# EasyEDA Pro project sincon_badge.eprj, board 2-PCB_PCB_Smooth_Yuzuki2040
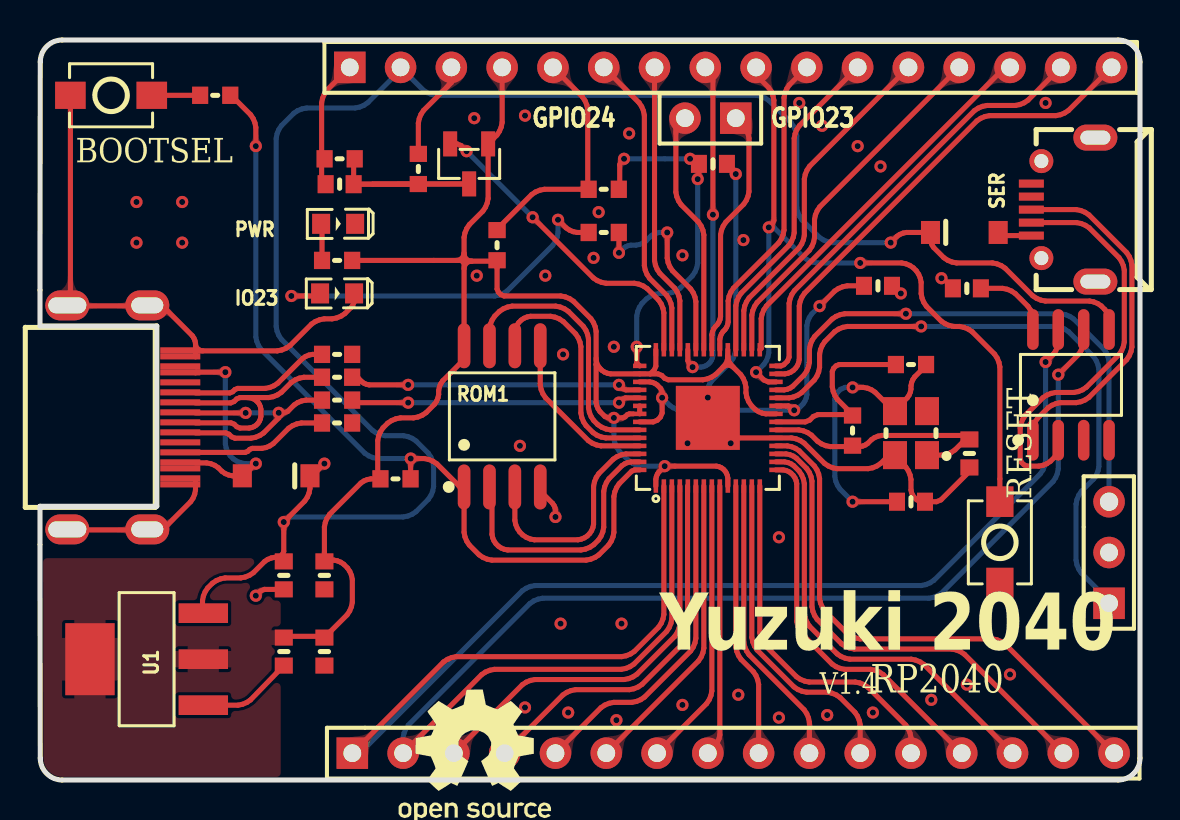
[diagram p4: board, top side]
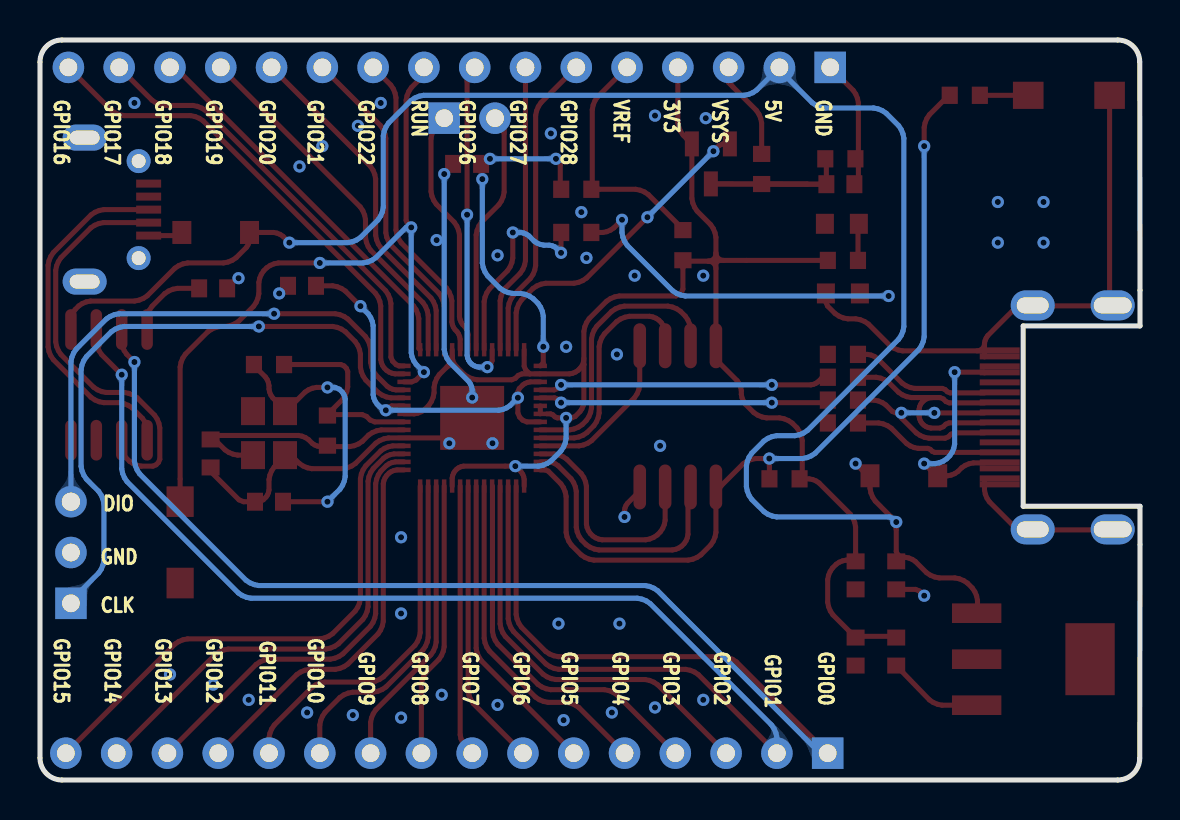
[diagram p5: board, bottom side, seen from below]

Outline 55.01 x 37 mm; copper layers: Top Layer, Bottom Layer. Coordinates in mm from the lower left corner of the outline.
Outline path: 0,24.48 0.01,35.9 arc(0.34,36.68) 1.11,37 53.91,37 arc(54.69,36.68) 55.01,35.9 55.01,1.1 arc(54.69,0.32) 53.91,0 1.11,0 arc(0.34,0.32) 0.01,1.1 0,11.76

## Design rules (mm)
via Default (default): diameter min 0.457, default 0.457, max 100.025; hole min 0.203, default 0.203, max 59.995
pour e307 uses gge9161
pour e1699 uses gge15034
pour e1701 uses gge15036

## Placement (name value [footprint] x y rotation side)
BOOTSEL  TSA343G00-250J2  [SW-SMD_L4.0-W2.9-LS5.0]  3.56 34.23 0 top
C1  0.1uf  [C0603 NSK]  12.19 6.42 270 top
C2  0.1uf  [C0603 NSK]  12.19 10.23 270 top
C3  0.1u  [C0603 NSK]  33.66 30.81 180 top
C4  0.1u  [C0603 NSK]  14.22 10.23 90 top
C5  2.2u  [C0603 NSK]  14.22 6.42 90 top
C6  1n  [C0603 NSK]  14.99 29.79 0 top
C7  15p  [C0603 NSK]  46.48 16.33 90 top
C8  15p  [C0603 NSK]  43.56 13.91 180 top
C9  0.1u  [C0603 NSK]  41.91 24.71 0 top
C10  10n  [C0603 NSK]  46.36 24.58 180 top
D1  1N4007W  [SOD-123 NSK]  11.81 15.21 180 top
D2  1N4007W  [SOD-123 NSK]  46.23 27.38 0 top
H1  HDR-F-2.54_1x3  [HDR-F-2.54_1X3]  53.47 11.37 90 top
H2  HDR-F-2.54_1x16  [HDR-F-2.54_1X16]  34.67 1.34 0 top
H3  HDR-F-2.54_1x16  [HDR-F-2.54_1X16]  34.54 35.63 0 top
H4  HDR-F-2.54_1x2  [HDR-F-2.54_1X2]  33.53 33.09 180 top
IO23  LED-0603_G  [LED0603_GREEN]  14.86 24.33 0 top
PWR  LED-0603_G  [LED0603_GREEN]  14.91 27.81 0 top
Q2  AO3404  [SOT-23-3_L2.9-W1.3-P1.90-LS2.4-BR]  21.46 30.81 90 top
R1  27  [R0603 NSK]  14.86 18.99 180 top
R2  27  [R0603 NSK]  14.86 20.14 180 top
R3  1K  [R0603 NSK]  14.86 25.98 180 top
R4  DNF（不装）  [R0603 NSK]  17.78 15.06 180 top
R5  1k  [R0603 NSK]  8.76 34.23 0 top
R6  1R  [R0603 NSK]  28.19 29.54 180 top
R7  200R  [R0603 NSK]  22.86 26.74 270 top
R8  470  [R0603 NSK]  28.19 27.38 180 top
R9  200k  [R0603 NSK]  18.92 30.55 90 top
R10  DNF  [R0603 NSK]  40.64 17.47 90 top
R11  100k  [R0603 NSK]  14.99 31.06 0 top
R12  1k  [R0603 NSK]  43.56 20.77 180 top
R13  1k  [R0603 NSK]  14.86 21.28 180 top
R14  1k  [R0603 NSK]  14.86 17.85 180 top
RESET  TSA343G00-250J2  [SW-SMD_L4.0-W2.9-LS5.0]  48.01 11.88 270 top
ROM1  W25Q16JVSSIQ  [SOIC-8_L5.3-W5.3-P1.27-LS8.0-BL]  23.11 18.18 0 top
SER  MICROUSB FEMALE  [MICRO-USB-SMD_5P-P0.65-H-F_C10418]  51.18 28.52 90 top
U1  AMS1117-3.3V  [SOT-223-4_L6.5-W3.5-P2.30-LS7.0-BR]  5.33 6.04 0 top
U2  RP2040  [QFN-56_L7.0-W7.0-P0.90-TL-EP3.2]  33.4 18.11 90 top
U3  CH340N  [SOP-8_L5.0-W4.0-P1.27-LS6.0-BL]  51.56 19.76 0 top
USB1  TYPE-C  [USB-C-SMD_TYC-302-16]  4.19 18.13 270 top
X1  12MHz  [OSC-SMD_4P-L3.2-W2.5-BL-1]  43.56 17.34 90 top

## Footprints (pads in the part's own frame, mm; a bottom-side part is the same pattern mirrored in y, then rotated)
C0603 NSK
  rect 0.8x0.9 smd: 1(-0.7,0) 2(0.7,0)
HDR-F-2.54_1X2
  rect 1.575x1.575 hole 0.889: 1(-1.27,0)
  round 1.575 hole 0.889: 2(1.27,0)
HDR-F-2.54_1X3
  rect 1.575x1.575 hole 0.889: 1(-2.54,0)
  round 1.575 hole 0.889: 2(0,0)
  round 1.575 hole 0.914: 3(2.54,0)
HDR-F-2.54_1X16
  rect 1.575x1.575 hole 0.889: 1(-19.05,0)
  round 1.575 hole 0.889: 2(-16.51,0) 3(-13.97,0) 4(-11.43,0) 5(-8.89,0) 6(-6.35,0) 7(-3.81,0) 8(-1.27,0) 9(1.27,0) 10(3.81,0) 11(6.35,0) 12(8.89,0) 13(11.43,0) 14(13.97,0) 15(16.51,0) 16(19.05,0)
LED0603_GREEN
  rect 0.9x1 smd: 1(-0.85,0) 2(0.85,0)
MICRO-USB-SMD_5P-P0.65-H-F_C10418
  oval 1.3x2.2 hole 0.7x1.5: 0(-3.6,-1.6) 0(3.6,-1.6)
  round 1.2 hole 0.7: 0(-2.425,1.1) 0(2.425,1.1)
  rect 0.4x1.25 smd: 1(-1.3,1.6) 2(-0.65,1.6) 3(0,1.6) 4(0.65,1.6) 5(1.3,1.6)
OSC-SMD_4P-L3.2-W2.5-BL-1
  rect 1.4x1.2 smd: 1(-1.1,-0.8) 2(1.1,-0.8) 3(1.1,0.8) 4(-1.1,0.8)
QFN-56_L7.0-W7.0-P0.90-TL-EP3.2
  rect 0.665x0.224 smd: 1(-3.408,2.6) 2(-3.408,2.2) 3(-3.408,1.8) 4(-3.408,1.4) 5(-3.408,1) 6(-3.408,0.6) 7(-3.408,0.2) 8(-3.408,-0.2) 9(-3.408,-0.6) 10(-3.408,-1) 11(-3.408,-1.4) 12(-3.408,-1.8) 13(-3.408,-2.2) 14(-3.408,-2.6) 29(3.408,-2.6) 30(3.408,-2.2) 31(3.408,-1.8) 32(3.408,-1.4) 33(3.408,-1) 34(3.408,-0.6) 35(3.408,-0.2) 36(3.408,0.2) 37(3.408,0.6) 38(3.408,1) 39(3.408,1.4) 40(3.408,1.8) 41(3.408,2.2) 42(3.408,2.6)
  rect 0.224x0.665 smd: 15(-2.6,-3.408) 16(-2.2,-3.408) 17(-1.8,-3.408) 18(-1.4,-3.408) 19(-1,-3.408) 20(-0.6,-3.408) 21(-0.2,-3.408) 22(0.2,-3.408) 23(0.6,-3.408) 24(1,-3.408) 25(1.4,-3.408) 26(1.8,-3.408) 27(2.2,-3.408) 28(2.6,-3.408) 43(2.6,3.408) 44(2.2,3.408) 45(1.8,3.408) 46(1.4,3.408) 47(1,3.408) 48(0.6,3.408) 49(0.2,3.408) 50(-0.2,3.408) 51(-0.6,3.408) 52(-1,3.408) 53(-1.4,3.408) 54(-1.8,3.408) 55(-2.2,3.408) 56(-2.6,3.408)
  rect 3.2x3.2 smd: 57(0,0)
R0603 NSK
  rect 0.806x0.864 smd: 1(-0.753,0) 2(0.753,0)
SOD-123 NSK
  rect 0.95x1.15 smd: 1(-1.692,0) 2(1.692,0)
SOIC-8_L5.3-W5.3-P1.27-LS8.0-BL
  oval 0.63x2.25 smd: 1(-1.905,-3.53) 2(-0.635,-3.53) 3(0.635,-3.53) 4(1.905,-3.53) 5(1.905,3.53) 6(0.635,3.53) 7(-0.635,3.53) 8(-1.905,3.53)
SOP-8_L5.0-W4.0-P1.27-LS6.0-BL
  oval 0.574x2.035 smd: 1(-1.905,-2.768) 2(-0.635,-2.768) 3(0.635,-2.768) 4(1.905,-2.768) 5(1.905,2.768) 6(0.635,2.768) 7(-0.635,2.768) 8(-1.905,2.768)
SOT-23-3_L2.9-W1.3-P1.90-LS2.4-BR
  rect 1.25x0.7 smd: 1(1,-0.95) 2(1,0.95) 3(-1,0)
SOT-223-4_L6.5-W3.5-P2.30-LS7.0-BR
  rect 2.47x0.98 smd: 1(2.835,-2.3) 2(2.835,0) 3(2.835,2.3)
  rect 2.47x3.6 smd: 4(-2.835,0)
SW-SMD_L4.0-W2.9-LS5.0
  rect 1.53x1.36 smd: 1(-2.035,0) 2(2.035,0)
USB-C-SMD_TYC-302-16
  oval 1.5x2.2 hole 0.8x1.6: 1(-5.6,1.175) 2(5.6,1.175)
  oval 1.5x2.2 hole 0.8x1.9: 3(-5.6,-2.825) 4(5.6,-2.825)
  rect 0.3x2 smd: A1(-3.35,2.825) A4(-2.55,2.825) A5(-1.25,2.825) A6(-0.25,2.825) A7(0.25,2.825) A8(-1.75,2.825) A9(2.55,2.825) A12(3.35,2.825) B1(3.05,2.825) B4(2.25,2.825) B5(1.75,2.825) B6(0.75,2.825) B7(-0.75,2.825) B8(1.25,2.825) B9(-2.25,2.825) B12(-3.05,2.825)

## Nets
1V1: C9.1 U2.23 U2.45 U2.50
3V3: C1.1 C4.2 C5.2 H3.4 Q2.1 R3.1 R4.2 R7.2 ROM1.8 U1.2 U1.4 U2.1 U2.10 U2.22 U2.33 U2.42 U2.44 U2.48 U2.49
GND: BOOTSEL.1 C1.2 C2.2 C3.1 C4.1 C5.1 C6.1 C7.1 C8.1 C9.2 C10.2 H1.2 H3.1 IO23.2 PWR.2 R11.1 R13.1 R14.1 RESET.2 ROM1.4 SER.0 SER.5 U1.1 U2.19 U2.57 U3.3 USB1.1 USB1.2 USB1.3 USB1.4 USB1.A1 USB1.A12 USB1.B1 USB1.B12 X1.2 X1.4
VBUS: C2.1 D1.1 D2.1 H3.2 U1.3 U3.5
ADC_AVDD: C3.2 R6.1 U2.43
ADC_VREF: H3.5 R6.2 R7.1
BOOTSEL_2: BOOTSEL.2 R5.1
CC1: R13.2 USB1.A5
CC2: R14.2 USB1.B5
D2_2: D2.2 SER.1
GPIO0: H2.1 U2.2 U3.7
GPIO1: H2.2 U2.3 U3.6
GPIO2: H2.3 U2.4
GPIO3: H2.4 U2.5
GPIO4: H2.5 U2.6
GPIO5: H2.6 U2.7
GPIO6: H2.7 U2.8
GPIO7: H2.8 U2.9
GPIO8: H2.9 U2.11
GPIO9: H2.10 U2.12
GPIO10: H2.11 U2.13
GPIO11: H2.12 U2.14
GPIO12: H2.13 U2.15
GPIO13: H2.14 U2.16
GPIO14: H2.15 U2.17
GPIO15: H2.16 U2.18
GPIO16: H3.16 U2.27
GPIO17: H3.15 U2.28
GPIO18: H3.14 U2.29
GPIO19: H3.13 U2.30
GPIO20: H3.12 U2.31
GPIO21: H3.11 U2.32
GPIO22: H3.10 U2.34
GPIO23: H4.1 U2.35
GPIO24: H4.2 U2.36
GPIO25: R8.1 U2.37
GPIO26_ADC0: H3.8 U2.38
GPIO27_ADC1: H3.7 U2.39
GPIO28_ADC2: H3.6 U2.40
GPIO29_ADC3: Q2.2 U2.41
PWR_1: PWR.1 R3.2
Q2_3: C6.2 Q2.3 R9.1 R11.2
QSPI_SCLK: ROM1.6 U2.52
QSPI_SD0: ROM1.5 U2.53
QSPI_SD1: ROM1.2 U2.55
QSPI_SD2: ROM1.3 U2.54
QSPI_SD3: ROM1.7 U2.51
QSPI_SS: R4.1 R5.2 ROM1.1 U2.56
R8_2: IO23.1 R8.2
RUN: H3.9 RESET.1 U2.26
SD+: SER.3 U3.1
SD-: SER.2 U3.2
SWCLK: H1.1 U2.24
SWDIO: H1.3 U2.25
U2_46: R2.1 U2.46
U2_47: R1.1 U2.47
U3_8: C10.1 U3.8
USB_D+: R1.2 USB1.A6 USB1.B6
USB_D-: R2.2 USB1.A7 USB1.B7
VSYS: H3.3 R9.2
VUSBC: D1.2 USB1.A4 USB1.A9 USB1.B4 USB1.B9
X1_3: C8.2 R12.1 X1.3
XIN: C7.2 R10.1 U2.20 X1.1
XOUT: R10.2 R12.2 U2.21

Pads without a net: SER 4; U3 4; USB1 A8 B8

## Via types
v1: diameter 0.61, hole 0.305, Top Layer to Bottom Layer, 84 vias

## Routing (per net, layer and track width the routed paths; a pad name or vN(x,y) marks a point on that pad's centre or on a via; arc(x,y) is an arc through that point)
1V1: length 20.3
  Top Layer w0.254: 36.81,18.71 37.42,18.71 37.56,18.65 37.72,18.49 ; U2.50 30.67,17.91 30.87,17.99 31.03,18.15 31.12,18.35 31.12,19.4 31.04,19.57 30.87,19.75 30.75,19.83 30.63,19.88 30.49,19.91 U2.45 ; v1(38.99,23.69) 39.74,24.45 39.94,24.58 40.15,24.66 40.38,24.71 41.01,24.71
  Bottom Layer w0.254: 31.11,19.11 31.5,18.73 31.68,18.61 31.87,18.53 32.08,18.49 37.85,18.49 38.16,18.8 38.25,18.94 38.32,19.1 38.35,19.27 38.35,22.72 38.4,22.93 38.48,23.12 38.6,23.3 v1(38.99,23.69) ; 37.54,18.49 arc(37.82,18.54) 38.06,18.7
  vias: v1(31.11,19.11) v1(37.72,18.49)
3V3: length 85.3
  Top Layer w0.254: 30.52,20.31 30.73,20.51 30.8,20.69 30.8,21.51 ; 30.52,20.31 U2.44 28.53,20.31 28.38,20.34 28.23,20.4 28.1,20.48 27.81,20.77 ; 30.52,20.31 30.91,20.31 31.1,20.23 31.24,20.09 31.42,20.01 33.16,20.01 33.38,20.06 33.6,20.15 33.79,20.27 34.4,20.88 34.4,20.91 ; 21.21,25.98 21.21,27.13 21.25,27.36 21.34,27.57 21.47,27.77 22.15,28.44 22.28,28.64 22.37,28.85 22.41,29.08 22.41,31.43 22.46,31.66 22.55,31.88 22.68,32.07 22.85,32.24 22.98,32.44 23.07,32.65 23.11,32.88 H3.4 ; 21.21,25.98 21.21,25.94 ; 21.21,25.98 21.08,25.98 ; 21.21,25.98 21.21,25.94 ; 12.19,7.18 14.28,7.18 ; 14.28,7.18 15.36,8.26 15.49,8.45 15.58,8.66 15.62,8.89 15.62,10.02 15.58,10.23 15.5,10.42 15.38,10.6 15.19,10.79 15.04,10.89 14.87,10.96 14.7,10.99 14.22,10.99 14.22,12.65 14.27,12.88 14.36,13.1 14.49,13.29 16.05,14.85 16.2,14.95 16.37,15.02 16.55,15.06 17.03,15.06 16.89,15.19 16.89,16.97 16.94,17.2 17.03,17.41 17.15,17.61 17.39,17.84 17.58,17.97 17.8,18.06 18.03,18.11 18.68,18.11 18.91,18.15 19.12,18.24 19.31,18.37 19.73,18.79 19.83,18.94 19.9,19.11 19.94,19.29 19.94,19.47 19.97,19.64 20.04,19.81 20.14,19.96 21.12,20.94 21.21,21.15 21.21,25.85 ; 14.28,7.18 C5.2 ; 34.4,20.91 35.04,20.27 35.17,20.08 35.26,19.87 35.31,19.64 35.31,19.37 35.35,19.14 35.44,18.92 35.57,18.73 35.78,18.53 35.94,18.42 36.11,18.34 36.3,18.31 36.81,18.31 ; 34.4,20.91 34.4,21.51 ; 15.66,25.98 21.08,25.98 ; 2.54,6.04 U1.4 ; 21.12,25.94 21.21,25.94 ; 21.12,25.94 21.21,25.85 ; 21.12,25.94 21.08,25.98 ; 21.21,25.94 21.21,25.85 ; 21.21,25.94 22.51,25.94 22.67,25.88 22.79,25.75 22.86,25.59 22.86,24.55 22.93,24.39 23.05,24.27 23.21,24.2 26.04,24.2 26.27,24.16 26.49,24.07 26.68,23.94 27.55,23.07 27.68,22.87 27.77,22.66 27.81,22.43 27.81,20.77 ; 27.81,20.77 27.81,18.89 27.85,18.72 27.91,18.56 28.01,18.42 28.25,18.18 28.42,18.11 v1(28.7,18.11) 29.14,18.11 29.26,18.16 29.37,18.26 29.47,18.31 29.66,18.31 ; U2.10 34.4,15.09 34.38,15.22 34.33,15.34 34.26,15.45 34.18,15.54 34.07,15.62 33.96,15.67 33.83,15.69 31.37,15.69 31.15,15.6 30.95,15.4 30.88,15.29 30.83,15.17 30.8,15.04 U2.1 ; U2.48 U2.49 ; 34.18,20.67 arc(34.34,20.91) 34.4,21.19 ; 21.21,26.32 arc(21.32,26.05) 21.59,25.94 arc(21.32,25.83) 21.21,25.56 ; 34.4,21.22 arc(34.46,20.94) 34.62,20.7 ; 20.83,25.98 arc(21.1,26.09) 21.21,26.36 ; 27.81,21.08 arc(27.87,20.8) 28.03,20.56 ; 34.69,20.63 arc(34.42,20.74) 34.15,20.63 ; 13.98,7.18 arc(14.26,7.24) 14.5,7.4 ; 14.22,11.37 arc(14.34,11.11) 14.61,10.99
  Bottom Layer w0.254: v1(31.24,15.69) 30.09,15.69 29.86,15.74 29.65,15.83 29.45,15.96 28.97,16.45 28.84,16.64 28.75,16.85 28.7,17.08 v1(28.7,18.11)
GND: length 76.6
  Top Layer w0.254: 7.78,21.46 11.87,21.46 12.1,21.5 12.31,21.59 12.5,21.72 13.58,22.8 13.77,22.92 13.99,23.01 14.22,23.06 14.61,23.06 14.84,23.1 15.06,23.19 15.25,23.32 15.63,23.7 15.71,23.89 15.71,24.2 ; 7.78,21.46 7.78,21.83 ; 7.78,21.46 7.78,21.16 ; 10.8,9.22 11.03,9.45 11.23,9.53 12.19,9.53 ; v1(34.8,30.3) 34.8,30.36 34.36,30.81 ; 7.78,21.83 7.75,21.97 7.69,22.1 7.62,22.22 6.39,23.44 6.2,23.57 5.98,23.66 5.75,23.71 1.76,23.71 1.65,23.75 1.57,23.84 1.52,23.95 BOOTSEL.1 ; 7.78,21.83 arc(7.89,21.56) 8.15,21.46 ; 25.02,14.45 25.64,13.83 25.71,13.72 25.76,13.61 25.78,13.48 25.78,13.15 ; 7.78,15.06 7.78,14.5 7.74,14.29 7.65,14.09 7.53,13.91 6.39,12.77 6.2,12.64 5.98,12.55 5.75,12.51 2.13,12.51 ; v1(34.54,16.84) 34.74,17.04 34.91,17.1 37.58,17.1 37.81,17.06 38.03,16.97 38.22,16.84 39.23,15.83 39.43,15.7 39.64,15.61 39.87,15.57 41.42,15.57 41.64,15.61 41.85,15.7 42.04,15.82 42.42,16.2 42.53,16.24 42.65,16.24 42.76,16.2 43.3,15.66 43.43,15.46 43.52,15.25 43.56,15.02 43.56,14.5 43.59,14.38 43.64,14.26 43.71,14.15 43.85,14.01 44.08,13.91 44.84,13.91 45.06,14.01 46.48,15.43 ; H3.1 14.35,34.49 14.22,34.29 14.13,34.08 14.08,33.85 14.08,29.79 ; C1.2 10.53,4.01 10.34,3.88 10.13,3.79 9.9,3.74 U1.1
  Bottom Layer w0.254: v1(33.4,19.12) 33.4,19.51 33.43,19.66 33.49,19.8 33.57,19.93 34.53,20.89 34.66,21.08 34.75,21.3 34.8,21.53 v1(34.8,30.3)
  vias: v1(4.83,28.9) v1(4.83,26.87) v1(7.11,28.9) v1(7.11,26.87) v1(10.79,9.22) v1(21.72,33.09) v1(21.84,25.22) v1(21.84,4.01) v1(24,16.71) v1(24.26,33.22) v1(24.26,3.63) v1(25.27,25.22) v1(25.78,13.15) v1(26.03,7.82) v1(26.16,21.28) v1(26.42,3.37) v1(27.69,26.11) v1(27.94,28.39) v1(28.7,21.66) v1(28.83,2.99) v1(29.08,7.82) v1(29.46,32.33) v1(32.13,26.23) v1(32.13,3.75) v1(32.39,16.84) v1(34.92,4.26) v1(35.18,27) v1(36.96,12.14) v1(36.96,8.33) v1(36.96,3.12) v1(37.97,33.85) v1(39.12,32.71) v1(39.37,3.25) v1(40.89,31.69) v1(41.66,3.37) v1(42.04,30.68) v1(43.05,24.33) v1(44.58,4.01) v1(45.09,25.09) v1(46.35,4.77) v1(48.51,5.28) v1(50.29,33.85)
VBUS: length 93.3
  Top Layer w0.254: U1.3 8.13,8.38 8.13,8.98 8.17,9.2 8.26,9.41 8.39,9.6 8.63,9.84 8.82,9.97 9.03,10.06 9.26,10.1 10.04,10.1 10.27,10.15 10.48,10.24 10.68,10.37 11.24,10.93 11.39,11.03 11.56,11.1 11.72,11.13 11.89,11.13 12.03,11.19 12.14,11.29 12.19,11.43 12.19,12.53 12.24,12.75 12.33,12.97 12.46,13.16 13.24,13.95 13.37,14.14 13.46,14.35 13.5,14.58 D1.1 13.61,15.21 v1(14.22,15.82) ; U3.5 53.47,23.01 53.43,23.2 53.36,23.37 53.25,23.52 53.07,23.71 52.9,23.82 52.7,23.91 52.49,23.95 50.28,23.95 50.06,23.99 49.84,24.08 49.65,24.21 48.27,25.59 48.08,25.72 47.86,25.81 47.63,25.85 45.84,25.85 45.61,25.9 45.4,25.99 45.2,26.12 44.7,26.62 44.62,26.74 44.56,26.87 44.54,27 44.54,27.14 44.49,27.25 44.41,27.33 44.3,27.38 43.33,27.38 43.16,27.34 43,27.28 42.86,27.18 v1(42.55,26.87)
  Bottom Layer w0.254: 18.1,35.57 19.17,34.5 19.36,34.37 19.57,34.28 19.8,34.23 35.82,34.23 36.05,34.19 36.27,34.1 36.46,33.97 37.58,32.85 37.71,32.65 37.8,32.44 37.85,32.21 37.85,28.64 37.89,28.41 37.98,28.2 38.11,28 38.98,27.13 39.17,27 39.39,26.91 39.62,26.87 v1(42.55,26.87) ; 18.1,35.57 18.03,35.63 18.03,35.5 ; 18.1,35.57 18.03,35.5 ; 18.03,35.5 16.39,33.86 16.2,33.73 15.98,33.65 15.76,33.6 13.33,33.6 13.1,33.55 12.88,33.47 12.69,33.34 12.07,32.72 11.95,32.53 11.86,32.31 11.81,32.08 11.81,22.67 11.86,22.44 11.95,22.23 12.07,22.03 16.63,17.48 16.82,17.35 17.04,17.26 17.26,17.22 18.17,17.22 18.4,17.17 18.61,17.08 18.81,16.95 19.42,16.34 19.55,16.14 19.64,15.93 19.69,15.7 19.69,14.67 19.64,14.44 19.55,14.23 19.42,14.03 18.81,13.42 18.61,13.29 18.4,13.2 18.17,13.15 12.54,13.15 12.38,13.09 12.19,12.9 ; 18.37,35.3 arc(18.1,35.41) 17.83,35.3
  vias: v1(12.19,12.9)
ADC_AVDD: length 17.4
  Top Layer w0.254: v1(32.51,31.06) 32.77,30.81 32.95,30.81 32.95,30.1 v1(32.89,30.04) ; v1(29.21,31.06) 29.05,30.9 28.99,30.76 28.99,29.54 ; v1(29.84,21.66) 29.84,20.85 29.99,20.7
  Bottom Layer w0.254: v1(29.84,21.66) 29.84,23.19 29.89,23.42 29.98,23.64 30.11,23.83 30.34,24.06 30.54,24.19 30.75,24.28 30.98,24.33 31.38,24.33 31.6,24.37 31.82,24.46 32.01,24.59 32.63,25.21 32.76,25.4 32.85,25.62 32.89,25.84 v1(32.89,30.04) ; v1(29.21,31.06) v1(32.51,31.06)
ADC_VREF: length 11.9
  Top Layer w0.254: H3.5 27.13,34.16 27.26,33.96 27.35,33.75 27.39,33.52 27.39,29.88 27.33,29.72 27.21,29.6 27.05,29.54 25.23,29.54 25,29.49 24.78,29.4 24.59,29.27 22.86,27.54
BOOTSEL_2: length 2.4
  Top Layer w0.254: 7.96,34.23 BOOTSEL.2
CC1: length 7
  Top Layer w0.254: R13.2 13.63,21.28 13.45,21.25 13.28,21.18 13.13,21.07 11.9,19.84 11.7,19.71 11.49,19.62 11.26,19.58 9.89,19.58 9.75,19.52 9.64,19.41 9.5,19.36 7.78,19.36
CC2: length 7.6
  Top Layer w0.254: USB1.B5 10.27,16.38 10.39,16.43 10.49,16.53 10.62,16.58 11.09,16.58 11.3,16.62 11.49,16.7 11.67,16.82 12.44,17.59 12.63,17.72 12.84,17.81 13.07,17.85 R14.2
D2_2: length 1.7
  Top Layer w0.254: 47.92,27.38 48.08,27.22 SER.1
GPIO0: length 73.1
  Top Layer w0.254: U3.7 50.93,21.88 50.89,21.67 50.8,21.47 50.69,21.29 v1(50.29,20.9) ; H2.1 20.18,5.9 20.38,6.03 20.59,6.12 20.82,6.17 29.09,6.17 29.32,6.21 29.53,6.3 29.73,6.43 30.94,7.64 31.07,7.83 31.16,8.05 31.2,8.28 U2.2
  Bottom Layer w0.254: H2.1 16,1.34 24.12,9.46 24.31,9.59 24.53,9.68 24.76,9.72 44.07,9.72 44.3,9.77 44.52,9.86 44.71,9.99 50.03,15.31 50.16,15.5 50.25,15.72 50.29,15.94 v1(50.29,20.9) ; 15.7,1.34 arc(15.98,1.4) 16.22,1.56
GPIO1: length 69.6
  Top Layer w0.254: v1(50.93,20.26) 51.93,21.27 52.06,21.46 52.15,21.68 52.2,21.91 U3.6 ; U2.3 31.6,8.06 31.56,7.84 31.47,7.62 31.34,7.43 29.7,5.8 29.51,5.67 29.3,5.58 29.07,5.53 22.72,5.53 22.5,5.49 22.28,5.4 22.09,5.27 H2.2
  Bottom Layer w0.254: 18.16,1.47 18.16,2.11 18.21,2.34 18.3,2.55 18.42,2.75 24.5,8.83 24.69,8.95 24.91,9.04 25.14,9.09 44.46,9.09 44.69,9.13 44.9,9.22 45.09,9.35 50.66,14.92 50.79,15.11 50.88,15.33 50.93,15.56 v1(50.93,20.26)
GPIO2: length 20.9
  Top Layer w0.254: 32,14.7 32,7.81 31.96,7.58 31.87,7.37 31.74,7.17 29.85,5.29 29.66,5.16 29.45,5.07 29.22,5.02 24.76,5.02 24.53,4.98 24.31,4.89 24.12,4.76 H2.3
GPIO3: length 19
  Top Layer w0.254: 32.39,14.7 32.39,7.43 32.34,7.2 32.25,6.99 32.12,6.79 30.11,4.78 29.92,4.65 29.7,4.56 29.47,4.52 26.79,4.52 26.56,4.47 26.35,4.38 26.15,4.25 H2.4
GPIO4: length 17.1
  Top Layer w0.254: H2.5 28.06,3.62 28.25,3.75 28.47,3.84 28.69,3.88 29.6,3.88 29.83,3.93 30.04,4.02 30.24,4.15 32.54,6.45 32.67,6.64 32.76,6.86 32.8,7.08 U2.6
GPIO5: length 15.3
  Top Layer w0.254: U2.7 33.2,6.59 33.16,6.37 33.07,6.15 32.94,5.96 H2.6
GPIO6: length 14.4
  Top Layer w0.254: H2.7 33.34,3.82 33.47,4.01 33.56,4.23 33.6,4.45 U2.8
GPIO7: length 13.6
  Top Layer w0.254: U2.9 34,2.26 33.96,2.07 33.88,1.88 33.77,1.71 H2.8
GPIO8: length 13.7
  Top Layer w0.254: U2.11 34.8,6.66 34.85,6.44 34.94,6.22 35.06,6.03 35.68,5.42 35.81,5.22 35.9,5.01 35.94,4.78 H2.9
GPIO9: length 14.6
  Top Layer w0.254: H2.10 38.48,2.87 38.44,3.1 38.35,3.32 38.22,3.51 35.46,6.26 35.33,6.46 35.24,6.67 35.2,6.9 35.2,14.7
GPIO10: length 16.5
  Top Layer w0.254: H2.11 41.02,2.75 40.98,2.98 40.89,3.19 40.76,3.38 40.01,4.13 39.82,4.26 39.61,4.34 39.38,4.39 38.35,4.39 38.12,4.44 37.9,4.52 37.71,4.65 35.86,6.5 35.74,6.69 35.65,6.91 35.6,7.13 U2.13
GPIO11: length 18.1
  Top Layer w0.254: 36,14.7 36,7.37 36.05,7.14 36.13,6.93 36.26,6.73 37.84,5.16 38.03,5.03 38.24,4.94 38.47,4.9 40.78,4.9 41,4.85 41.22,4.76 41.41,4.63 43.3,2.75 43.43,2.55 43.52,2.34 43.56,2.11 H2.12
GPIO12: length 19.3
  Top Layer w0.254: 36.81,15.5 37.17,15.5 37.31,15.48 37.44,15.42 37.56,15.35 37.67,15.23 37.76,15.1 37.82,14.96 37.85,14.82 37.85,7.94 37.89,7.71 37.98,7.49 38.11,7.3 39.61,5.8 39.81,5.67 40.02,5.58 40.25,5.53 41.54,5.53 41.77,5.49 41.98,5.4 42.17,5.27 H2.13
GPIO13: length 21.9
  Top Layer w0.254: 36.81,15.91 37.24,15.91 37.4,15.87 37.56,15.81 37.69,15.72 37.96,15.45 38.09,15.25 38.18,15.04 38.23,14.81 38.23,8.32 38.27,8.09 38.36,7.88 38.49,7.68 39.87,6.3 40.06,6.18 40.28,6.09 40.5,6.04 43.57,6.04 43.8,6 44.01,5.91 44.21,5.78 H2.14
GPIO14: length 24.5
  Top Layer w0.254: H2.15 46.24,6.28 46.04,6.41 45.83,6.5 45.6,6.55 40.72,6.55 40.49,6.59 40.28,6.68 40.09,6.81 38.87,8.03 38.74,8.22 38.65,8.43 38.61,8.66 38.61,14.94 38.56,15.17 38.47,15.38 38.34,15.58 37.83,16.09 37.67,16.19 37.5,16.27 37.31,16.3 U2.17
GPIO15: length 27
  Top Layer w0.254: 36.81,16.71 37.37,16.71 37.59,16.66 37.79,16.58 37.97,16.46 38.73,15.7 38.85,15.51 38.94,15.29 38.99,15.07 38.99,9.08 39.03,8.85 39.12,8.64 39.25,8.44 40.38,7.32 40.57,7.19 40.78,7.1 41.01,7.06 47.63,7.06 47.86,7.01 48.08,6.92 48.27,6.79 H2.16
GPIO16: length 24.9
  Top Layer w0.254: 36.81,20.31 37.25,20.31 37.41,20.34 37.55,20.4 37.68,20.48 37.8,20.59 37.88,20.73 37.94,20.87 37.97,21.02 37.97,23.7 38.02,23.93 38.11,24.14 38.24,24.34 46.85,32.96 47.05,33.08 47.26,33.17 47.49,33.22 50.81,33.22 51.04,33.26 51.25,33.35 51.44,33.48 H3.16
GPIO17: length 22.1
  Top Layer w0.254: H3.15 49.41,33.99 49.22,33.86 49,33.77 48.78,33.73 47.36,33.73 47.13,33.68 46.92,33.59 46.73,33.46 37.73,24.47 37.6,24.27 37.51,24.06 37.47,23.83 37.47,21.15 37.38,20.94 37.2,20.77 37.06,20.7 36.81,20.7
GPIO18: length 19.4
  Top Layer w0.254: 36,21.51 36.07,21.58 36.07,23.07 36.11,23.3 36.2,23.51 36.33,23.7 48.26,35.63 H3.14
GPIO19: length 18.3
  Top Layer w0.254: H3.13 39,28.66 38.87,28.46 38.78,28.25 38.74,28.02 38.74,27.11 38.69,26.89 38.6,26.67 38.47,26.48 35.86,23.87 35.74,23.68 35.65,23.46 35.6,23.23 35.6,21.51
GPIO20: length 17.4
  Top Layer w0.254: H3.12 38.49,30.69 38.36,30.49 38.27,30.28 38.23,30.05 38.23,27.24 38.18,27.01 38.09,26.8 37.96,26.61 35.46,24.1 35.33,23.91 35.24,23.7 35.2,23.47 35.2,21.51
GPIO21: length 16.5
  Top Layer w0.254: H3.11 37.98,32.72 37.85,32.53 37.76,32.31 37.72,32.08 37.72,27.37 37.67,27.14 37.58,26.93 37.46,26.73 35.06,24.34 34.94,24.15 34.85,23.93 34.8,23.7 34.8,21.51
GPIO22: length 15.7
  Top Layer w0.254: 34,21.51 34,22.04 34.03,22.17 34.08,22.3 34.16,22.42 34.26,22.52 34.34,22.64 34.39,22.76 34.42,22.9 34.42,23.96 34.46,24.18 34.55,24.4 34.68,24.59 36.95,26.86 37.08,27.05 37.17,27.27 37.21,27.5 37.21,34.12 37.26,34.34 37.35,34.56 37.47,34.75 H3.10
GPIO23: length 12.4
  Top Layer w0.254: U2.35 33.6,22.26 33.63,22.41 33.69,22.54 33.77,22.66 33.87,22.77 33.95,22.89 34.01,23.02 34.04,23.17 34.04,27.26 34.08,27.49 34.17,27.7 34.3,27.89 35.19,28.79 35.32,28.98 35.41,29.2 35.46,29.43 35.46,32.08 35.42,32.29 35.33,32.5 35.21,32.68 34.8,33.09
GPIO24: length 12.8
  Top Layer w0.254: H4.2 31.8,32.63 31.8,29.4 31.85,29.17 31.94,28.96 32.06,28.76 32.94,27.89 33.07,27.7 33.16,27.48 33.2,27.26 U2.36 ; 32.02,32.85 arc(31.86,32.61) 31.8,32.33
GPIO25: length 10.1
  Top Layer w0.254: 28.96,26.36 28.96,27.34 28.99,27.38 ; U2.37 32.8,23.92 32.76,24.15 32.67,24.36 32.54,24.56 31.63,25.46 31.5,25.66 31.41,25.87 31.37,26.1 31.37,27.38
  Bottom Layer w0.254: v1(28.96,26.36) 29.19,26.6 29.3,26.67 29.42,26.72 29.54,26.74 29.81,26.74 29.99,26.78 30.15,26.85 30.3,26.95 30.56,27.21 30.69,27.29 30.83,27.35 30.98,27.38 v1(31.37,27.38)
GPIO26_ADC0: length 17.4
  Top Layer w0.254: 32.4,21.51 32.4,20.97 32.46,20.82 32.64,20.65 ; H3.8 33.66,35.25 v1(33.66,28.27) ; 33.66,34.94 arc(33.6,35.23) 33.44,35.47
  Bottom Layer w0.254: v1(33.66,28.27) 33.66,21.23 33.63,21.11 33.58,20.99 33.51,20.88 33.42,20.79 33.31,20.72 33.19,20.67 33.07,20.65 32.64,20.65
  vias: v1(32.64,20.65)
GPIO27_ADC1: length 14.5
  Top Layer w0.254: U2.39 32,23.96 31.96,24.19 31.87,24.4 31.74,24.59 31,25.34 30.87,25.53 30.78,25.74 30.73,25.97 H3.7
GPIO28_ADC2: length 15.4
  Top Layer w0.254: H3.6 29.96,33.86 30.09,33.67 30.18,33.46 30.23,33.23 30.23,25.72 30.27,25.49 30.36,25.27 30.49,25.08 31.34,24.23 31.47,24.04 31.56,23.83 31.6,23.6 U2.40
GPIO29_ADC3: length 16.1
  Top Layer w0.254: v1(24.64,28.14) 27.68,25.1 27.87,24.97 28.08,24.88 28.31,24.84 29.73,24.84 29.95,24.79 30.17,24.7 30.36,24.57 30.94,24 31.07,23.8 31.16,23.59 31.2,23.36 31.2,21.51 ; Q2.2 20.85,31.81 21.05,31.72 21.34,31.44
  Bottom Layer w0.254: v1(21.34,31.44) v1(24.64,28.14)
PWR_1: length 1.8
  Top Layer w0.254: 14.06,27.81 14.1,27.76 R3.2
Q2_3: length 14.7
  Top Layer w0.254: 16.64,29.8 R9.1 ; 15.69,29.79 15.69,31.01 15.74,31.06 ; 16.64,29.79 Q2.3 15.89,29.79 16.64,29.79
QSPI_SCLK: length 12.3
  Top Layer w0.254: 23.75,21.51 23.75,22.4 23.78,22.57 23.85,22.73 23.94,22.87 24.06,22.99 24.21,23.09 24.36,23.15 24.53,23.19 25.54,23.19 25.76,23.14 25.98,23.05 26.17,22.92 26.79,22.31 26.92,22.11 27.01,21.9 27.05,21.67 27.05,18.35 27.1,18.12 27.19,17.91 27.31,17.71 27.66,17.37 27.85,17.24 28.07,17.15 28.29,17.1 U2.52
QSPI_SD0: length 8.1
  Top Layer w0.254: 25.02,21.51 25.02,19.75 25.06,19.52 25.15,19.31 25.28,19.11 27.43,16.97 27.62,16.84 27.83,16.75 28.06,16.71 U2.53
QSPI_SD1: length 13.2
  Top Layer w0.254: U2.55 29.56,15.91 29.4,15.87 29.24,15.81 29.11,15.72 28.46,15.07 28.33,14.87 28.24,14.66 28.19,14.43 28.19,12.64 28.15,12.41 28.06,12.19 27.93,12 27.7,11.77 27.5,11.64 27.29,11.55 27.06,11.5 23.39,11.5 23.22,11.54 23.06,11.6 22.92,11.7 22.8,11.82 22.7,11.96 22.64,12.12 22.61,12.28 22.61,14.32 22.48,14.45
QSPI_SD2: length 11.3
  Top Layer w0.254: U2.54 29.31,16.3 29.08,16.26 28.86,16.17 28.67,16.04 27.95,15.32 27.82,15.13 27.73,14.91 27.69,14.69 27.69,12.79 27.65,12.62 27.59,12.47 27.49,12.32 27.37,12.2 27.23,12.11 27.07,12.04 26.9,12.01 24.73,12.01 24.52,12.05 24.32,12.13 24.14,12.25 23.99,12.4 23.87,12.58 23.79,12.78 23.75,12.99 23.75,14.45
QSPI_SD3: length 14
  Top Layer w0.254: U2.51 28.53,17.51 28.3,17.55 28.09,17.64 27.9,17.77 27.7,17.97 27.57,18.16 27.48,18.38 27.43,18.61 27.43,22.05 27.39,22.28 27.3,22.49 27.17,22.69 26.43,23.43 26.23,23.56 26.02,23.65 25.79,23.69 23.61,23.69 23.39,23.65 23.17,23.56 22.98,23.43 22.74,23.2 22.61,23 22.52,22.79 22.48,22.56 22.48,21.51
QSPI_SS: length 42.5
  Top Layer w0.254: v1(18.54,16.07) 19.21,16.07 19.44,16.03 19.65,15.94 19.85,15.81 20.95,14.71 21.07,14.52 21.16,14.3 21.21,14.08 21.21,12.38 21.25,12.15 21.34,11.94 21.47,11.75 21.96,11.26 22.16,11.13 22.37,11.04 22.6,10.99 27.31,10.99 27.54,11.04 27.76,11.13 27.95,11.26 28.44,11.75 28.57,11.94 28.66,12.15 28.7,12.38 28.7,14.18 28.75,14.41 28.84,14.62 28.97,14.81 29.6,15.44 29.74,15.5 U2.56 ; 9.56,34.23 10.53,33.27 10.66,33.07 10.75,32.86 10.8,32.63 10.8,31.69 ; 18.53,16.07 18.53,15.06 ; 18.92,16.07 arc(18.65,15.96) 18.53,15.69
  Bottom Layer w0.254: 10.8,31.69 10.8,22.16 10.84,21.93 10.93,21.72 11.06,21.53 16.25,16.34 16.44,16.21 16.65,16.12 16.88,16.07 v1(18.54,16.07)
  vias: v1(10.79,31.69)
R8_2: length 18.6
  Top Layer w0.254: v1(12.57,24.2) 14.01,24.2 ; 25.91,28.01 26.31,27.61 26.48,27.49 26.67,27.42 26.87,27.38 27.39,27.38
  Bottom Layer w0.254: v1(12.57,24.2) 22.74,24.2 22.97,24.25 23.18,24.34 23.38,24.46 25.64,26.73 25.77,26.93 25.86,27.14 25.91,27.37 v1(25.91,28.01)
RUN: length 39.4
  Top Layer w0.254: v1(35.81,20.39) 36.21,20 36.43,19.9 36.81,19.9 ; H3.9 35.81,35.25 36.44,34.62 36.57,34.43 36.66,34.22 36.7,33.99 36.7,27.98 36.64,27.82 v1(36.45,27.63) ; v1(41.02,25.85) 43.09,25.85 43.3,25.81 43.5,25.73 43.68,25.61 43.83,25.46 43.95,25.28 44.03,25.08 44.07,24.88 44.07,24.32 44.11,24.09 44.2,23.88 44.33,23.68 45.08,22.94 45.27,22.81 45.48,22.72 45.71,22.68 45.98,22.68 46.21,22.63 46.43,22.54 46.62,22.41 47.74,21.29 47.87,21.1 47.96,20.88 48.01,20.65 RESET.1 ; 35.81,35.56 arc(35.87,35.27) 36.03,35.03
  Bottom Layer w0.254: v1(41.02,25.85) 38.85,25.85 38.63,25.9 38.41,25.99 38.22,26.12 36.7,27.63 v1(36.45,27.63) 36.45,21.37 36.41,21.16 36.33,20.96 36.21,20.78 v1(35.81,20.39)
SD+: length 17.8
  Top Layer w0.254: 49.66,16.99 49.66,17.52 49.7,17.72 49.78,17.91 49.89,18.08 50.41,18.6 50.6,18.73 50.82,18.82 51.05,18.87 51.82,18.87 52.05,18.91 52.27,19 52.46,19.13 54.35,21.02 54.48,21.21 54.56,21.43 54.61,21.65 54.61,25.73 54.56,25.96 54.48,26.18 54.35,26.37 52.46,28.26 52.27,28.39 52.05,28.47 51.82,28.52 SER.3
SD-: length 21.1
  Top Layer w0.254: SER.2 51.84,27.87 52.07,27.82 52.28,27.73 52.48,27.61 53.97,26.12 54.09,25.92 54.18,25.71 54.23,25.48 54.23,21.91 54.18,21.68 54.09,21.46 53.97,21.27 52.33,19.64 52.14,19.51 51.93,19.42 51.7,19.38 50.79,19.38 50.56,19.33 50.35,19.24 50.16,19.11 49.29,18.24 49.16,18.05 49.07,17.83 49.02,17.61 49.02,16.04 49.09,15.88 49.21,15.76 49.37,15.69 49.95,15.69 50.16,15.73 50.36,15.82 50.53,15.93 50.75,16.15 50.84,16.28 50.9,16.43 50.93,16.58 50.93,16.99
SWCLK: length 32
  Top Layer w0.254: v1(44.07,22.68) 40.38,22.68 40.15,22.63 39.94,22.54 39.74,22.41 39.25,21.93 39.12,21.73 39.03,21.52 38.99,21.29 38.99,20.64 38.94,20.41 38.85,20.19 38.73,20 38.09,19.37 37.9,19.24 37.69,19.15 37.46,19.11 U2.24
  Bottom Layer w0.254: H1.1 53.47,8.96 52.08,10.35 51.95,10.54 51.86,10.76 51.82,10.98 51.82,13.8 51.86,14.02 51.95,14.24 52.08,14.43 52.7,15.05 52.82,15.24 52.91,15.46 52.96,15.68 52.96,20.53 52.91,20.76 52.82,20.97 52.7,21.16 51.44,22.41 51.25,22.54 51.04,22.63 50.81,22.68 v1(44.07,22.68)
SWDIO: length 27
  Top Layer w0.254: U2.25 37.22,19.51 37.37,19.54 37.52,19.6 37.65,19.68 38.22,20.26 38.35,20.45 38.44,20.66 38.48,20.89 38.48,21.54 38.53,21.77 38.62,21.99 38.74,22.18 39.61,23.05 39.81,23.18 40.02,23.27 40.25,23.31 v1(43.31,23.31)
  Bottom Layer w0.254: v1(43.31,23.31) 51.06,23.31 51.29,23.27 51.5,23.18 51.7,23.05 53.2,21.54 53.33,21.35 53.42,21.14 53.47,20.91 53.47,13.91
U2_46: length 14.6
  Top Layer w0.254: R2.1 15.81,20.14 15.92,20.09 16.11,19.9 16.22,19.83 16.34,19.78 16.46,19.76 18.42,19.76 ; 28.96,19.76 29.14,19.57 29.3,19.51 U2.46
  Bottom Layer w0.254: v1(28.96,19.76) 18.41,19.76
  vias: v1(18.41,19.76)
U2_47: length 14.5
  Top Layer w0.254: 18.42,18.87 15.79,18.87 15.66,18.99 ; U2.47 29.28,19.11 29.13,19.04 28.96,18.87
  Bottom Layer w0.254: v1(28.96,18.87) 18.41,18.87
  vias: v1(18.41,18.87)
U3_8: length 3.9
  Top Layer w0.254: U3.8 49.66,23.09 49.61,23.3 49.53,23.51 49.41,23.69 48.78,24.32 48.58,24.45 48.37,24.54 48.14,24.58 47.06,24.58
USB_D+: length 11.3
  Top Layer w0.254: 7.78,17.36 9.29,17.36 9.45,17.29 9.58,17.16 9.75,17.09 10.55,17.09 10.78,17.14 10.99,17.22 11.19,17.35 11.94,18.11 v1(11.94,18.36) 12.22,18.36 12.39,18.43 12.71,18.75 12.89,18.87 13.09,18.95 13.3,18.99 14.06,18.99 ; 7.78,18.35 10.29,18.35
  Bottom Layer w0.254: 10.29,18.36 v1(11.94,18.36)
  vias: v1(10.29,18.36)
USB_D-: length 12
  Top Layer w0.254: 7.78,18.86 9.54,18.86 9.71,18.92 9.84,19.05 10,19.12 10.67,19.12 ; 10.67,19.12 10.9,18.89 10.97,18.78 11.02,18.66 11.05,18.54 11.05,18.18 11.02,18.06 10.97,17.94 10.9,17.83 10.81,17.74 10.71,17.67 10.59,17.62 10.46,17.6 10,17.6 9.84,17.67 9.71,17.79 9.55,17.86 7.78,17.86 ; 10.67,19.12 11.44,19.12 11.67,19.17 11.88,19.26 12.07,19.39 12.56,19.87 12.76,20 12.97,20.09 13.2,20.14 R2.2 ; 10.89,18.9 arc(10.64,19.07) 10.36,19.12
VSYS: length 5.5
  Top Layer w0.254: H3.3 20.57,34.87 19.19,33.48 19.06,33.29 18.97,33.07 18.92,32.85 R9.2 ; 20.36,34.65 arc(20.52,34.89) 20.57,35.18
VUSBC: length 11.2
  Top Layer w0.254: v1(10.8,15.82) 10.19,15.21 D1.2 9.63,15.21 9.44,15.25 9.26,15.32 9.11,15.43 8.92,15.61 8.74,15.73 8.54,15.81 8.33,15.86 7.78,15.86 ; 7.78,20.36 7.81,20.39 v1(9.27,20.39) ; 9.88,15.21 arc(10.16,15.27) 10.4,15.43
  Bottom Layer w0.254: v1(9.27,20.39) 9.27,16.8 9.31,16.59 9.39,16.39 9.51,16.21 9.67,16.06 9.84,15.94 10.04,15.86 10.25,15.82 v1(10.8,15.82)
X1_3: length 14
  Top Layer w0.254: 44.36,20.77 43.74,20.16 43.65,20.02 43.59,19.87 43.56,19.71 43.56,19.55 43.53,19.39 43.47,19.25 43.38,19.11 42.96,18.69 42.8,18.62 42.62,18.62 42.46,18.69 41.76,19.39 41.59,19.51 41.39,19.59 41.19,19.63 40.64,19.63 ; 42.66,13.91 40.64,13.91
  Bottom Layer w0.254: v1(40.64,19.63) 40.26,19.63 40.04,19.54 39.9,19.39 39.82,19.29 39.78,19.17 39.75,19.04 39.75,15.18 39.8,14.95 39.88,14.73 40.01,14.54 v1(40.64,13.91)
XIN: length 12.2
  Top Layer w0.254: 36.81,17.51 37.95,17.51 38.17,17.46 38.39,17.37 38.58,17.24 38.89,16.93 39.08,16.8 39.3,16.72 39.53,16.67 41.01,16.67 41.15,16.7 41.28,16.75 41.4,16.83 41.58,17.01 41.74,17.12 41.91,17.19 42.09,17.23 46.23,17.23 46.3,17.05 45.76,16.51 45.57,16.38 45.35,16.29 45.13,16.24 44.41,16.24
XOUT: length 9.5
  Top Layer w0.254: 42.76,20.77 39.97,20.77 39.81,20.71 39.69,20.58 39.62,20.43 39.62,19.66 39.67,19.43 39.76,19.22 39.89,19.02 40.46,18.45 40.39,18.27 38.91,18.27 38.68,18.18 38.5,18 38.27,17.91 36.81,17.91

## Copper pours and planes (outline as drawn; the poured copper is in the pictures)
3V3 on Top Layer: -0.76,10.99 -0.76,-0.44 -0.13,-1.07 12.32,-1.07 11.94,-0.69 11.94,10.99
GND on Top Layer: -3.05,38.93 -3.05,10.87 11.94,10.87 11.94,-0.69 12.32,-1.07 57.91,-1.07 57.91,38.81
GND on Bottom Layer: -2.67,39.19 -2.67,-3.74 -0.89,-5.52 60.58,-5.52 60.83,-5.26 60.83,36.77 58.42,39.19

Small or netless copper shapes (teardrops, artwork), in the pictures only: 90 on Top Layer, 51 on Bottom Layer

## Text on the board
Bottom Silkscreen Layer: GPIO0 | GND | 5V | GPIO1 | GPIO2 | VSYS | 3V3 | GPIO3 | VREF | GPIO4 | GPIO5 | GPIO28 | GPIO6 | GPIO27 | GPIO7 | GPIO26 | GPIO8 | RUN | GPIO9 | GPIO22 | GPIO10 | GPIO21 | GPIO11 | GPIO20 | GPIO12 | GPIO19 | GPIO13 | GPIO18 | GPIO14 | GPIO17 | GPIO16 | GPIO15 | DIO | CLK
Top Silkscreen Layer: GPIO24 | GPIO23 | Yuzuki 2040 | V1.4 | RP2040
